# EAGLE design VoiceRecognition (EAGLE 9.2.1)
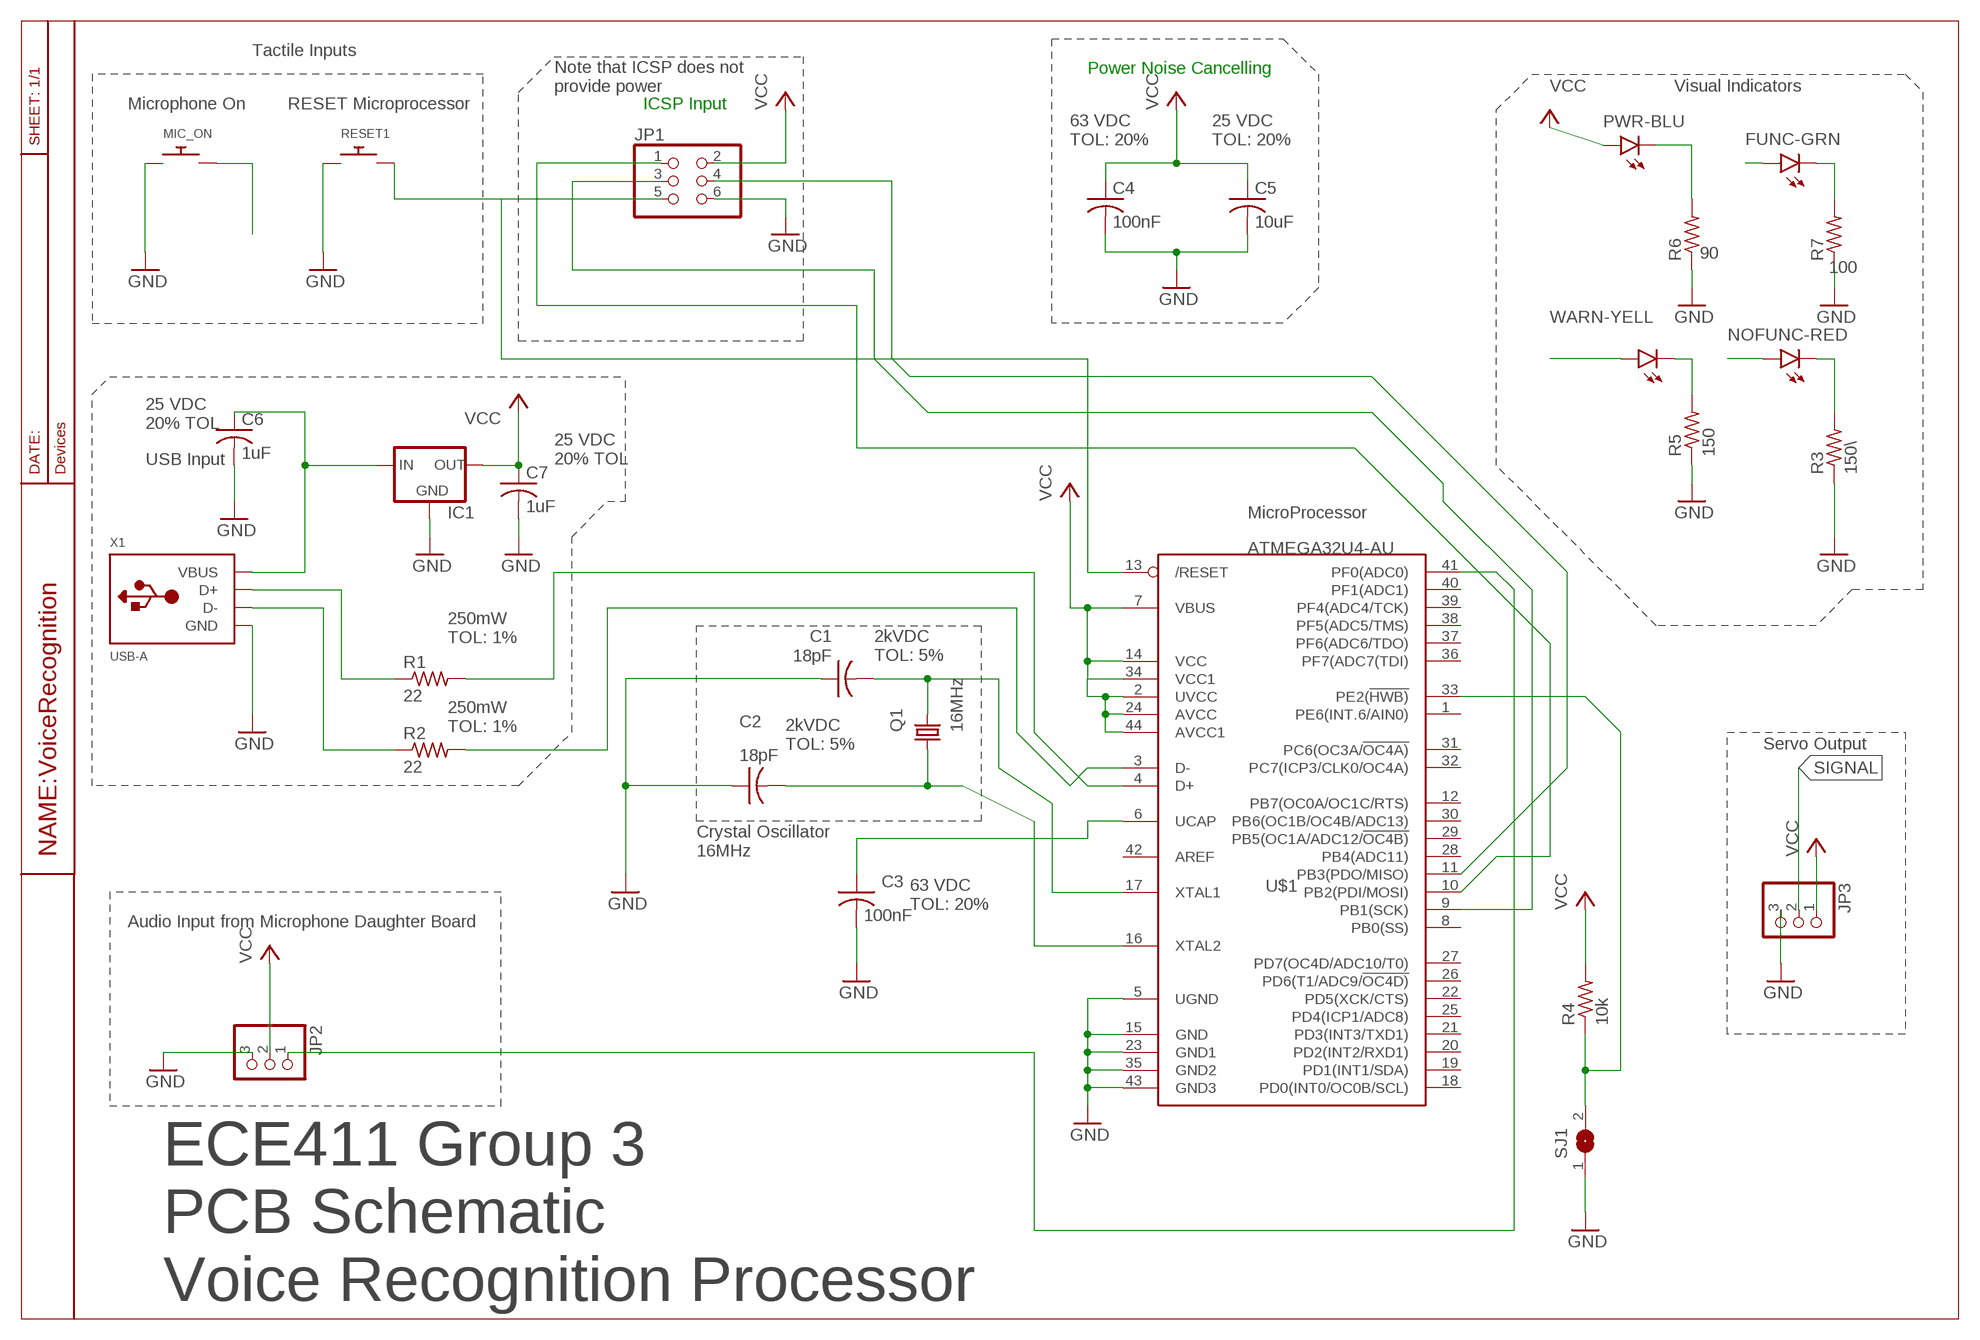
[diagram p0: schematic, sheet 1]

## Parts
C1  18pF  C-USC1206  [C1206]
C2  18pF  C-USC1206  [C1206]
C3  100nF  C-USC1206  [C1206]
C4  100nF  C-USC1206  [C1206]
C5  10uF  C-USC1206  [C1206]
C6  1uF  C-USC1206  [C1206]
C7  1uF  C-USC1206  [C1206]
IC1  MCP1700INLINE  [TO92-INLINE]
JP1  PINHD-2X3  [2X03]
JP2  PINHD-1X3  [1X03]
JP3  PINHD-1X3  [1X03]
LED2  LEDSMT1206  [1206]
LED3  LEDSMT1206  [1206]
LED4  LEDSMT1206  [1206]
MIC_ON  SWITCH_PUSHBUTTONC&K_KSS  [BTN_CK_KSS]
PWR-BLU  LEDSMT1206  [1206]
Q1  16MHz  CRYSTALCTS406  [CTS406]
R1  22  R-US_M1206  [M1206]
R2  22  R-US_M1206  [M1206]
R3  150\  R-US_M1206  [M1206]
R4  10k  R-US_M1206  [M1206]
R5  150  R-US_M1206  [M1206]
R6  90  R-US_M1206  [M1206]
R7  100  R-US_M1206  [M1206]
RESET1  SWITCH_PUSHBUTTONC&K_KSS  [BTN_CK_KSS]
SJ1  SJW  [SJW]
U$1  ATMEGA32U4-AU  [TQFP44]
X1  USB-A  [MOLEX_480371000]

## Nets
FUNC-GRN: LED2.A
GND: C1.1 C2.1 C3.2 C4.2 C5.2 C6.2 C7.2 IC1.1(GND) JP1.6 JP2.3 JP3.3 MIC_ON.P$1 R3.1 R5.1 R6.1 R7.1 RESET1.P$1 SJ1.1 U$1.5(UGND) U$1.15(GND) U$1.23(GND1) U$1.35(GND2) U$1.43(GND3) X1.4(GND)
HWB: R4.1 SJ1.2 U$1.33(PE2(!HWB))
N$1: C3.1 U$1.6(UCAP)
N$2: R2.2 U$1.3(D-)
N$3: R1.1 X1.3(D+)
N$4: JP1.3 U$1.9(PB1(SCK))
N$5: PWR-BLU.C R6.2
N$6: LED2.C R7.2
N$7: LED4.C R5.2
N$8: LED3.C R3.2
N$9: R2.1 X1.2(D-)
N$10: C6.1 IC1.2(IN) X1.1(VBUS)
N$11: MIC_ON.P$2
N$12: R1.2 U$1.4(D+)
N$13: JP1.1 U$1.10(PB2(PDI/MOSI))
N$15: JP2.1 U$1.41(PF0(ADC0))
N$16: C2.2 Q1.1 U$1.16(XTAL2)
N$17: JP1.4 U$1.11(PB3(PDO/MISO))
N$19: C1.2 Q1.3 U$1.17(XTAL1)
NOFUNC-RED: LED3.A
RST: JP1.5 RESET1.P$2 U$1.13(/RESET)
SIGNAL: JP3.2
VCC: C4.1 C5.1 C7.1 IC1.3(OUT) JP1.2 JP2.2 JP3.1 PWR-BLU.A R4.2 U$1.2(UVCC) U$1.7(VBUS) U$1.14(VCC) U$1.24(AVCC) U$1.34(VCC1) U$1.44(AVCC1)
WARN: LED4.A
Unconnected: U$1.1(PE6(INT.6/AIN0)) U$1.8(PB0(SS)) U$1.12(PB7(OC0A/OC1C/RTS)) U$1.18(PD0(INT0/OC0B/SCL)) U$1.19(PD1(INT1/SDA)) U$1.20(PD2(INT2/RXD1)) U$1.21(PD3(INT3/TXD1)) U$1.22(PD5(XCK/CTS)) U$1.25(PD4(ICP1/ADC8)) U$1.26(PD6(T1/ADC9/!OC4D)) U$1.27(PD7(OC4D/ADC10/T0)) U$1.28(PB4(ADC11)) U$1.29(PB5(OC1A/ADC12/!OC4B)) U$1.30(PB6(OC1B/OC4B/ADC13)) U$1.31(PC6(OC3A/!OC4A)) U$1.32(PC7(ICP3/CLK0/OC4A)) U$1.36(PF7(ADC7(TDI)) U$1.37(PF6(ADC6/TDO)) U$1.38(PF5(ADC5/TMS)) U$1.39(PF4(ADC4/TCK)) U$1.40(PF1(ADC1)) U$1.42(AREF)

## Notes on the sheet
- Tactile Inputs
- Power Noise Cancelling
- Note that ICSP does not
  provide power
- Visual Indicators
- Microphone On | RESET Microprocessor | ICSP Input
- PWR-BLU
- 63 VDC
  TOL: 20%
- 25 VDC
  TOL: 20%
- WARN-YELL
- 25 VDC
  20% TOL
- USB Input
- 25 VDC
  20% TOL
- MicroProcessor
- 250mW
  TOL: 1%
- 2kVDC
  TOL: 5%
- 250mW
  TOL: 1%
- 2kVDC
  TOL: 5%
- Servo Output
- Crystal Oscillator
  16MHz
- 63 VDC
  TOL: 20%
- Audio Input from Microphone Daughter Board
- ECE411 Group 3
  PCB Schematic
  Voice Recognition Processor

## Library data of the parts
C1-C7 = rcl:C-US: CAPACITOR, American symbol; SPICEPREFIX: C
IC1 = adafruit:MCP1700: VOLTAGE REGULATOR; VENDOR: Mouser; VPN: 579-MCP1700-5002E/TO
JP1 = pinhead:PINHD-2X3: PIN HEADER
JP2 JP3 = pinhead:PINHD-1X3: PIN HEADER
LED2-LED4 PWR-BLU = led:LED: LED OSRAM: - CHIPLED LG R971, LG N971, LY N971, LG Q971, LY Q971, LO R971, LY R971 LH N974, LH R974 LS Q976, LO Q976, LY Q976 LO Q996 - Hyper CHIPLED LW Q18S LB Q993, LB Q99A, LB R99A - SideLED LS A670, LO A670, LY A670, LG A670, LP A670 LB A673, LV A673, LT A673, LW A673 LH A674 LY A675 LS A676, LA A676, LO A676, LY A676, LW A676 LS A679, LY A679, LG A679 - Hyper Micro SIDELED® LS Y876, LA Y876, LO Y876, LY Y876 LT Y87S - SmartLED LW L88C, LW L88S LB L89C, LB L89S, LG L890 LS L89K, LO L89K, LY L89K LS L896, LA L896, LO L896, LY L896 - TOPLED LS T670, LO T670, LY T670, LG T670, LP T670 LSG T670, LSP T670, LSY T670, LOP T670, LYG T670 LG T671, LOG T671, LSG T671 LB T673, LV T673, LT T673, LW T673 LH T674 LS T676, LA T676, LO T676, LY T676, LB T676, LH T676, LSB T676, LW T676 LB T67C, LV T67C, LT T67C, LS T67K, LO T67K, LY T67K, LW E67C LS E67B, LA E67B, LO E67B, LY E67B, LB E67C, LV E67C, LT E67C LW T67C LS T679, LY T679, LG T679 LS T770, LO T770, LY T770, LG T770, LP T770 LB T773, LV T773, LT T773, LW T773 LH T774 LS E675, LA E675, LY E675, LS T675 LS T776, LA T776, LO T776, LY T776, LB T776 LHGB T686 LT T68C, LB T68C - Hyper Mini TOPLED® LB M676 - Mini TOPLED Santana® LG M470 LS M47K, LO M47K, LY M47K Source: http://www.osram.convergy.de LUXEON: - LUMILED® LXK2-PW12-R00, LXK2-PW12-S00, LXK2-PW14-U00, LXK2-PW14-V00 LXK2-PM12-R00, LXK2-PM12-S00, LXK2-PM14-U00 LXK2-PE12-Q00, LXK2-PE12-R00, LXK2-PE12-S00, LXK2-PE14-T00, LXK2-PE14-U00 LXK2-PB12-K00, LXK2-PB12-L00, LXK2-PB12-M00, LXK2-PB14-N00, LXK2-PB14-P00, LXK2-PB14-Q00 LXK2-PR12-L00, LXK2-PR12-M00, LXK2-PR14-Q00, LXK2-PR14-R00 LXK2-PD12-Q00, LXK2-PD12-R00, LXK2-PD12-S00 LXK2-PH12-R00, LXK2-PH12-S00 LXK2-PL12-P00, LXK2-PL12-Q00, LXK2-PL12-R00 Source: www.luxeon.com KINGBRIGHT: KA-3528ASYC Source: www.kingbright.com
MIC_ON RESET1 = adafruit:SWITCH_PUSHBUTTON: Buttons SOFTTOUCHSMD_SJ - Soft touch temporary push button (Super Junk Akihabara) Compatible with SKPMANE010 [Mouser: 688-SKPMAN] C&K_KSS = Digikey: KSS221GLFS
Q1 = adafruit:CRYSTAL: CRYSTAL; OC_FARNELL: unknown; OC_NEWARK: unknown
R1-R7 = rcl:R-US_: RESISTOR, American symbol; SPICEPREFIX: R
SJ1 = jumper:SJ: SMD solder JUMPER
U$1 = adafruit:ATMEGA32U4: http://www.ladyada.net/library/eagle
X1 = adafruit:USB-A: USB type A 'plug' Used for things that can directly connect to a USB port, say USB key

## Board
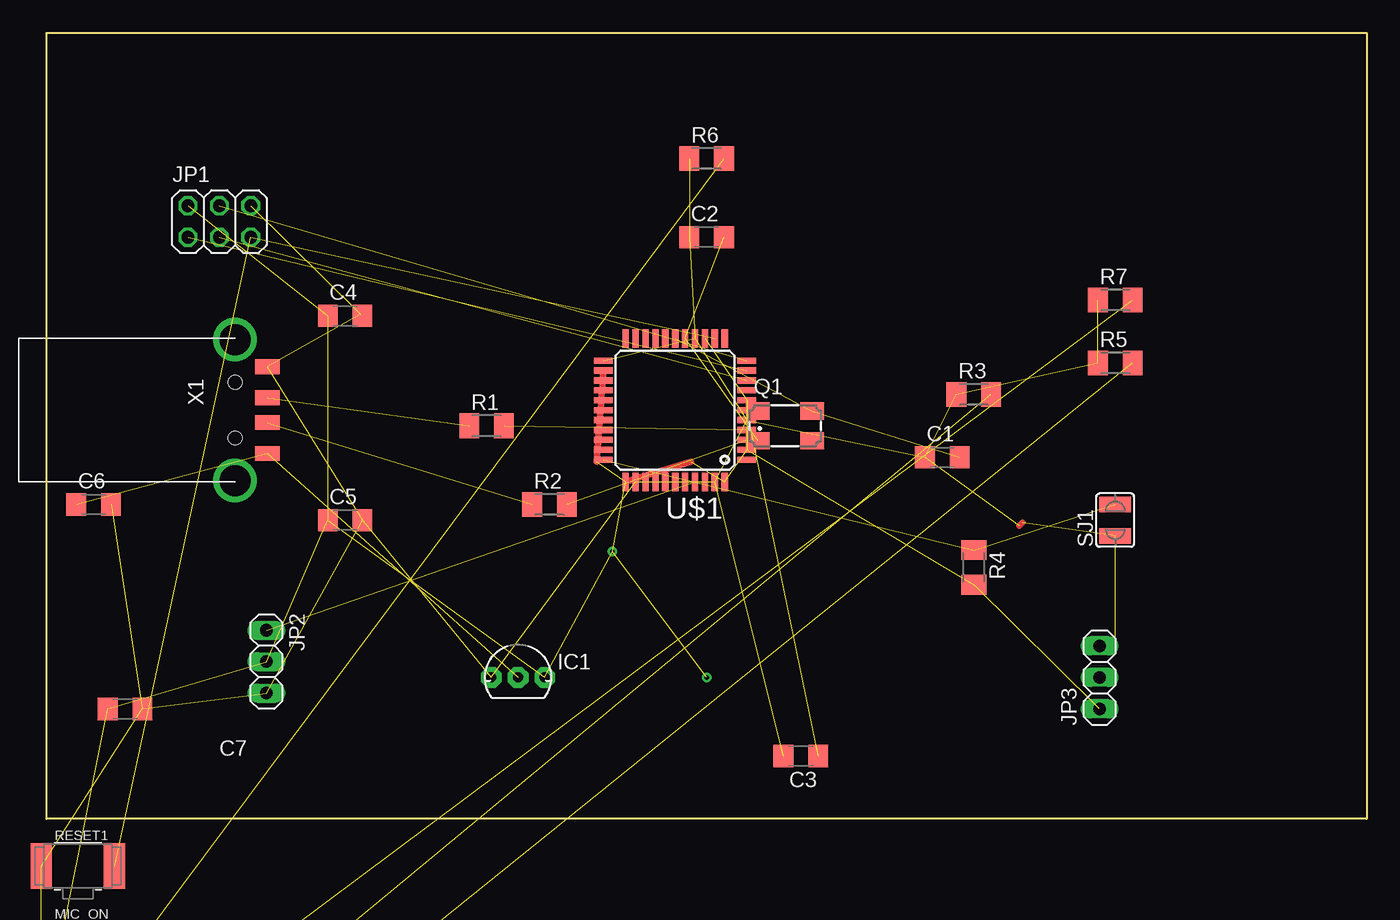
[diagram p1: board, top side]

Size 106.68 x 63.5 mm. Coordinates in mm from the lower left corner, seen from the top.
Outline: 0,0 0,63.5 106.68,63.5 106.68,0 0,0
Copper layers (1*16): Top 0.035mm / dielectric 1.5mm / Bottom 0.035mm
Design rules "default": minimum track width 6mil, minimum drill 0.35mm, track to track 6mil, track to pad 6mil, pad to pad 6mil, via to via 6mil, smd to smd 6mil, copper to edge 40mil, drill to drill 6mil, minimum pad ring 10mil, minimum via ring 8mil, stop-mask expansion 4mil, vias tented up to drill 0mil, thermal gap 10mil

### Footprints (pad centres in the part's own frame; a part is rotated, then mirrored left to right if it is on the bottom)
C1206 = smd 1.6 x 1.8: 1 -1.4,0; 2 1.4,0
TO92-INLINE = drill 0.813 pad 1.676 octagon: 1 -2.159,0; 2 0,0; 3 2.159,0
2X03 = drill 1.016 octagon: 1 -2.54,-1.27; 2 -2.54,1.27; 3 0,-1.27; 4 0,1.27; 5 2.54,-1.27; 6 2.54,1.27
1X03 = drill 1.016 long: 1 -2.54,0; 2 0,0; 3 2.54,0
1206 = smd 1.6 x 1.803: A -1.422,0; C 1.422,0
BTN_CK_KSS = smd 1.7 x 3.7: P$1 -2.95,0; P$2 2.95,0
CTS406 = smd 1.9 x 1.4: 1 -2.2,-1.2; 2 2.2,-1.2; 3 2.2,1.2; 4 -2.2,1.2
M1206 = smd 1.6 x 2: 1 -1.4,0; 2 1.4,0
SJW = smd 1.27 x 2.54: 1 -1.27,0; 2 1.27,0
TQFP44 = smd 1.5 x 0.5: 1 -5.8,4; 2 -5.8,3.2; 3 -5.8,2.4; 4 -5.8,1.6; 5 -5.8,0.8; 6 -5.8,0; 7 -5.8,-0.8; 8 -5.8,-1.6; 9 -5.8,-2.4; 10 -5.8,-3.2; 11 -5.8,-4; 23 5.8,-4; 24 5.8,-3.2; 25 5.8,-2.4; 26 5.8,-1.6; 27 5.8,-0.8; 28 5.8,0; 29 5.8,0.8; 30 5.8,1.6; 31 5.8,2.4; 32 5.8,3.2; 33 5.8,4 | smd 0.5 x 1.5: 12 -4,-5.8; 13 -3.2,-5.8; 14 -2.4,-5.8; 15 -1.6,-5.8; 16 -0.8,-5.8; 17 0,-5.8; 18 0.8,-5.8; 19 1.6,-5.8; 20 2.4,-5.8; 21 3.2,-5.8; 22 4,-5.8; 34 4,5.8; 35 3.2,5.8; 36 2.4,5.8; 37 1.6,5.8; 38 0.8,5.8; 39 0,5.8; 40 -0.8,5.8; 41 -1.6,5.8; 42 -2.4,5.8; 43 -3.2,5.8; 44 -4,5.8
MOLEX_480371000 = smd 1.2 x 2: 1 3.5,2.6; 2 1,2.6; 3 -1,2.6; 4 -3.5,2.6 | drill 2.5: M1 -5.7,0; M2 5.7,0 | hole 1.1: -2.25,0; 2.25,0

### Placement (x,y rotation side)
C1  72.39,29.21 0 top
C2  53.34,46.99 0 top
C3  60.96,5.08 180 top
C4  24.13,40.64 0 top
C5  24.13,24.13 0 top
C6  3.81,25.4 0 top
C7  6.35,8.89 0 top
IC1  38.1,11.43 0 top
JP1  13.97,48.26 0 top
JP2  17.78,12.7 270 top
JP3  85.09,11.43 90 top
LED2  1.27,-21.59 0 top  (outside the outline)
LED3  1.27,-26.67 0 top  (outside the outline)
LED4  1.27,-31.75 0 top  (outside the outline)
MIC_ON  2.54,-10.16 0 top  (outside the outline)
PWR-BLU  1.27,-16.51 0 top  (outside the outline)
Q1  59.69,31.75 0 top
R1  35.56,31.75 0 top
R2  40.64,25.4 0 top
R3  74.93,34.29 0 top
R4  74.93,20.32 270 top
R5  86.36,36.83 0 top
R6  53.34,53.34 0 top
R7  86.36,41.91 0 top
RESET1  2.54,-3.81 0 top  (outside the outline)
SJ1  86.36,24.13 90 top
U$1  50.8,33.02 180 top
X1  15.24,33.02 270 top

### Tracks (layer width: path | path; a pad name or v marks a point on that pad's centre or on a via)
GND  (24 unrouted)
  Top 0.508: 86.36,13.97 JP3.3 | 78.84,23.94 78.6,23.7 | 25.4,40.77 C4.2
HWB  (2 unrouted)
N$1  (1 unrouted)
N$2  (1 unrouted)
N$3  (1 unrouted)
N$4  (1 unrouted)
N$5  (1 unrouted)
N$6  (1 unrouted)
N$7  (1 unrouted)
N$8  (1 unrouted)
N$9  (1 unrouted)
N$10  (2 unrouted)
N$12  (1 unrouted)
N$13  (1 unrouted)
N$15  (1 unrouted)
N$16  (2 unrouted)
N$17  (1 unrouted)
N$18
  Top 0.152: 106.68,63.5 0,63.5 0,0 106.68,0
N$19  (2 unrouted)
RST  (2 unrouted)
VCC  (via drill 0.35)  (16 unrouted)
  Top 0.508: U$1.24 44.45,28.85 | 52.07,28.84 U$1.34
  other vias: 45.72,21.59 53.34,11.43